# EAGLE design DRV_RGB_PRG (EAGLE 6.5.0)
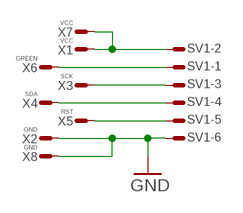
[diagram p0: schematic, sheet 1]

## Parts
SV1  ML6ES  [ML6S]
X1  VCC  WIREPADT1.6/0.9  [T1.6/0.9]
X2  GND  WIREPADT1.6/0.9  [T1.6/0.9]
X3  SCK  WIREPADT1.6/0.9  [T1.6/0.9]
X4  SDA  WIREPADT1.6/0.9  [T1.6/0.9]
X5  RST  WIREPADT1.6/0.9  [T1.6/0.9]
X6  GREEN  WIREPADT1.6/0.9  [T1.6/0.9]
X7  VCC  WIREPADT1.6/0.9  [T1.6/0.9]
X8  GND  WIREPADT1.6/0.9  [T1.6/0.9]

## Nets
GND: SV1.6 X2.1(S) X8.1(S)
GREEN: SV1.1 X6.1(S)
N$7: SV1.5 X5.1(S)
SCK: SV1.3 X3.1(S)
SDA: SV1.4 X4.1(S)
VCC: SV1.2 X1.1(S) X7.1(S)

## Library data of the parts
SV1 = Conn:ML6E: HARTING
X1-X8 = Conn:WIREPAD: Wire PAD connect wire on PCB

## Board
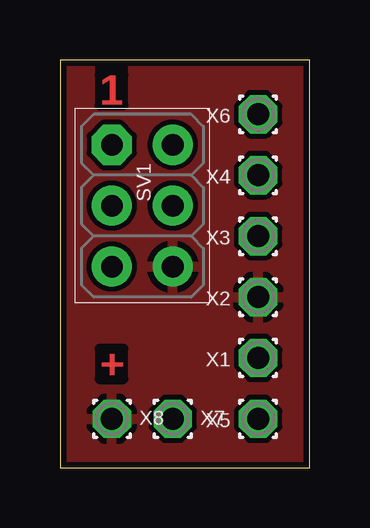
[diagram p1: board, top side]
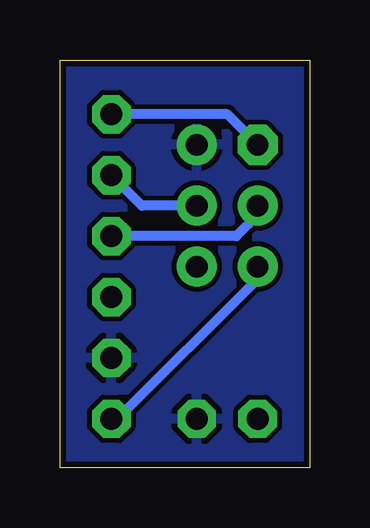
[diagram p2: board, bottom side, seen from below]

Size 10.4 x 17 mm. Coordinates in mm from the lower left corner, seen from the top.
Outline: 0,0 10.4,0 10.4,17 0,17 0,0
Copper layers (1*16): Top 0.035mm / dielectric 1.5mm / Bottom 0.035mm
Design rules "default *": minimum track width 10mil, minimum drill 24mil, track to track 8mil, track to pad 8mil, pad to pad 8mil, via to via 8mil, smd to smd 8mil, copper to edge 10mil, drill to drill 8mil, minimum pad ring 10mil, minimum via ring 8mil, stop-mask expansion 4mil, vias tented up to drill 0mil, thermal gap 10mil

### Footprints (pad centres in the part's own frame; a part is rotated, then mirrored left to right if it is on the bottom)
ML6S = drill 0.9 pad 1.676 octagon: 1 -2.54,-1.27 | drill 0.9 pad 1.676: 2 -2.54,1.27; 3 0,-1.27; 4 0,1.27; 5 2.54,-1.27; 6 2.54,1.27
T1.6/0.9 = drill 0.914 pad 1.6 octagon: 1 0,0

### Placement (x,y rotation side)
SV1  3.43,10.92 270 top
X1  8.26,4.57 180 top
X2  8.26,7.11 180 top
X3  8.26,9.65 180 top
X4  8.26,12.19 180 top
X5  8.26,2.03 180 top
X6  8.26,14.73 180 top
X7  4.7,2.03 0 top
X8  2.16,2.03 0 top

### Tracks (layer width: path | path; a pad name or v marks a point on that pad's centre or on a via)
GND
  pour Top: 0,0 10.41,0 10.41,16.99 0,16.99
GREEN
  Bottom 0.406: SV1.1 3.43,14.73 X6.1
N$7
  Bottom 0.406: X5.1 8,2.03 2.16,7.87 SV1.5
SCK
  Bottom 0.406: SV1.3 2.16,10.54 3.05,9.65 X3.1
SDA
  Bottom 0.406: SV1.4 6.99,10.92 X4.1
VCC
  pour Bottom: 0,0 10.41,0 10.41,16.99 0,16.99

### Text on the board
Top: 1 | +